# EAGLE design garage door opener v2 2015 07 16 (EAGLE 7.3.0)
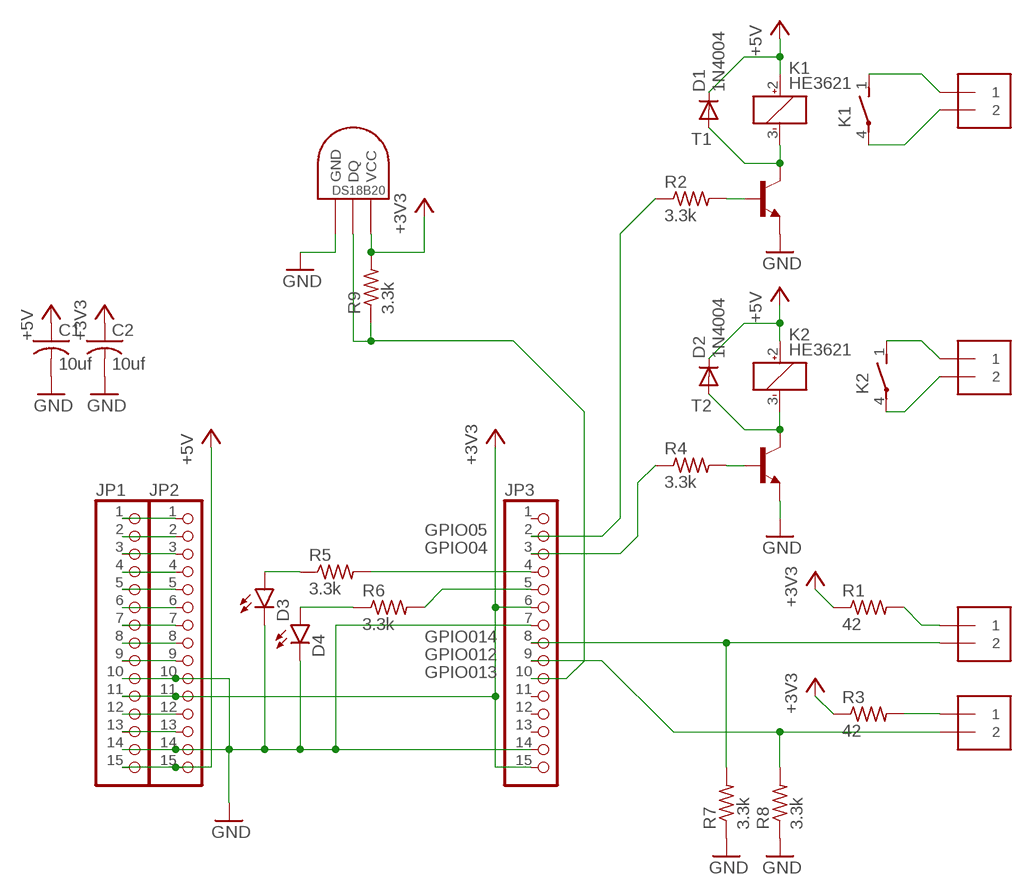
[diagram p0: schematic, sheet 1]

## Parts
C1  10uf  C-USC0603  [C0603]
C2  10uf  C-USC0603  [C0603]
D1  1N4004  DIODE-DO214BA  [DO214BA]
D2  1N4004  DIODE-DO214BA  [DO214BA]
D3  LED0603  [LED-0603]
D4  LED0603  [LED-0603]
DS18B20  DS18B20TO92  DS1820TO92  [DS1820]
JP1  PINHD-1X15  [1X15]
JP2  PINHD-1X15  [1X15]
JP3  PINHD-1X15  [1X15]
K1  HE3621  [HE3621]
K2  HE3621  [HE3621]
OPEN1  1X2-3.5MM  [1X2-3.5MM]
OPEN2  1X2-3.5MM  [1X2-3.5MM]
R1  42  R-US_R0603  [R0603]
R2  3.3k  R-US_R0603  [R0603]
R3  42  R-US_R0603  [R0603]
R4  3.3k  R-US_R0603  [R0603]
R5  3.3k  R-US_R0603  [R0603]
R6  3.3k  R-US_R0603  [R0603]
R7  3.3k  R-US_R0603  [R0603]
R8  3.3k  R-US_R0603  [R0603]
R9  3.3k  R-US_R0603  [R0603]
SENS1  1X2-3.5MM  [1X2-3.5MM]
SENS2  1X2-3.5MM  [1X2-3.5MM]
T1  MMBT3904LT1-NPN-SOT23-BEC  [SOT23-BEC]
T2  MMBT3904LT1-NPN-SOT23-BEC  [SOT23-BEC]

## Nets
+3V3: C2.1 DS18B20.VDD(VCC) JP1.11 JP2.11 JP3.6 JP3.15 R1.1 R3.1 R9.2
+5V: C1.1 D1.C D2.C JP1.15 JP2.15 K1.2(1:+) K2.2(1:+)
GND: C1.2 C2.2 D3.C D4.C DS18B20.GND JP1.10 JP1.14 JP2.10 JP2.14 JP3.7 JP3.14 R7.1 R8.1 T1.E T2.E
N$1: JP1.1 JP2.1
N$2: JP1.2 JP2.2
N$3: JP1.3 JP2.3
N$4: JP1.4 JP2.4
N$5: JP1.5 JP2.5
N$6: JP1.6 JP2.6
N$7: JP1.7 JP2.7
N$8: JP1.8 JP2.8
N$9: JP1.9 JP2.9
N$10: K1.1(2:S) OPEN1.1
N$11: K1.4(2:P) OPEN1.2
N$12: JP1.12 JP2.12
N$13: JP1.13 JP2.13
N$14: JP3.8 R7.2 SENS1.2
N$15: R1.2 SENS1.1
N$16: D1.A K1.3(1:-) T1.C
N$17: JP3.2 R2.1
N$18: R2.2 T1.B
N$19: JP3.4 R5.2
N$20: JP3.5 R6.2
N$21: R3.2 SENS2.1
N$22: JP3.9 R8.2 SENS2.2
N$23: K2.1(2:S) OPEN2.1
N$24: K2.4(2:P) OPEN2.2
N$25: D2.A K2.3(1:-) T2.C
N$26: JP3.3 R4.1
N$27: R4.2 T2.B
N$28: D4.A R6.1
N$29: D3.A R5.1
N$30: DS18B20.DQ JP3.10 R9.1
Unconnected: JP3.1 JP3.11 JP3.12 JP3.13

## Notes on the sheet
- GPIO05
- GPIO04
- GPIO014
- GPIO012
- GPIO013

## Library data of the parts
C1 C2 = resistor:C-US: CAPACITOR, American symbol
D1 D2 = diode:DIODE-: DIODE
D3 D4 = SparkFun-LED:LED: LEDs Standard schematic elements and footprints for 5mm, 3mm, 1206, and 0603 sized LEDs. 5mm - Spark Fun Electronics SKU : COM-00529 (and others)
DS18B20 = Ava:DS1820: DS18B20 Programmable Resolution 1-Wire Digital Thermometer Description The DS18B20 digital thermometer provides 9-bit to 12-bit Celsius temperature measurements and has an alarm function with nonvolatile user-programmable upper and lower trigger points. The DS18B20 communicates over a 1-Wire® bus that by definition requires only one data line (and ground) for communication with a central microprocessor. It has an operating temperature range of -55°C to +125°C and is accurate to ±0.5°C over the range of -10°C to +85°C. In addition, the DS18B20 can derive power directly from the data line ("parasite power"), eliminating the need for an external power supply. Each DS18B20 has a unique 64-bit serial code, which allows multiple DS18B20s to function on the same 1-Wire bus. Thus, it is simple to use one microprocessor to control many DS18B20s distributed over a large area. Applications that can benefit from this feature include HVAC environmental controls, temperature monitoring systems inside buildings, equipment, or machinery, and process monitoring and control systems.
JP1-JP3 = pinhead:PINHD-1X15: PIN HEADER
K1 K2 = relay:HE3621: RELAY reed, 1 x norm. open, grid 5.08 mm, Hamlin; MF: HAMLIN; MPN: HE3621A0510; OC_FARNELL: 9561943; OC_NEWARK: 50F7993
OPEN1 OPEN2 SENS1 SENS2 = adafruit:1X2: 3.5mm Terminal block http://www.ladyada.net/library/pcb/eaglelibrary.html; MPN: OSTTE020161
R1-R9 = resistor:R-US_: RESISTOR, American symbol
T1 T2 = transistor-neu-to92:*-NPN-: NPN Transistror; MPN: MMBT2222A

## Net classes
0 default: width 0.406 mm

## Board
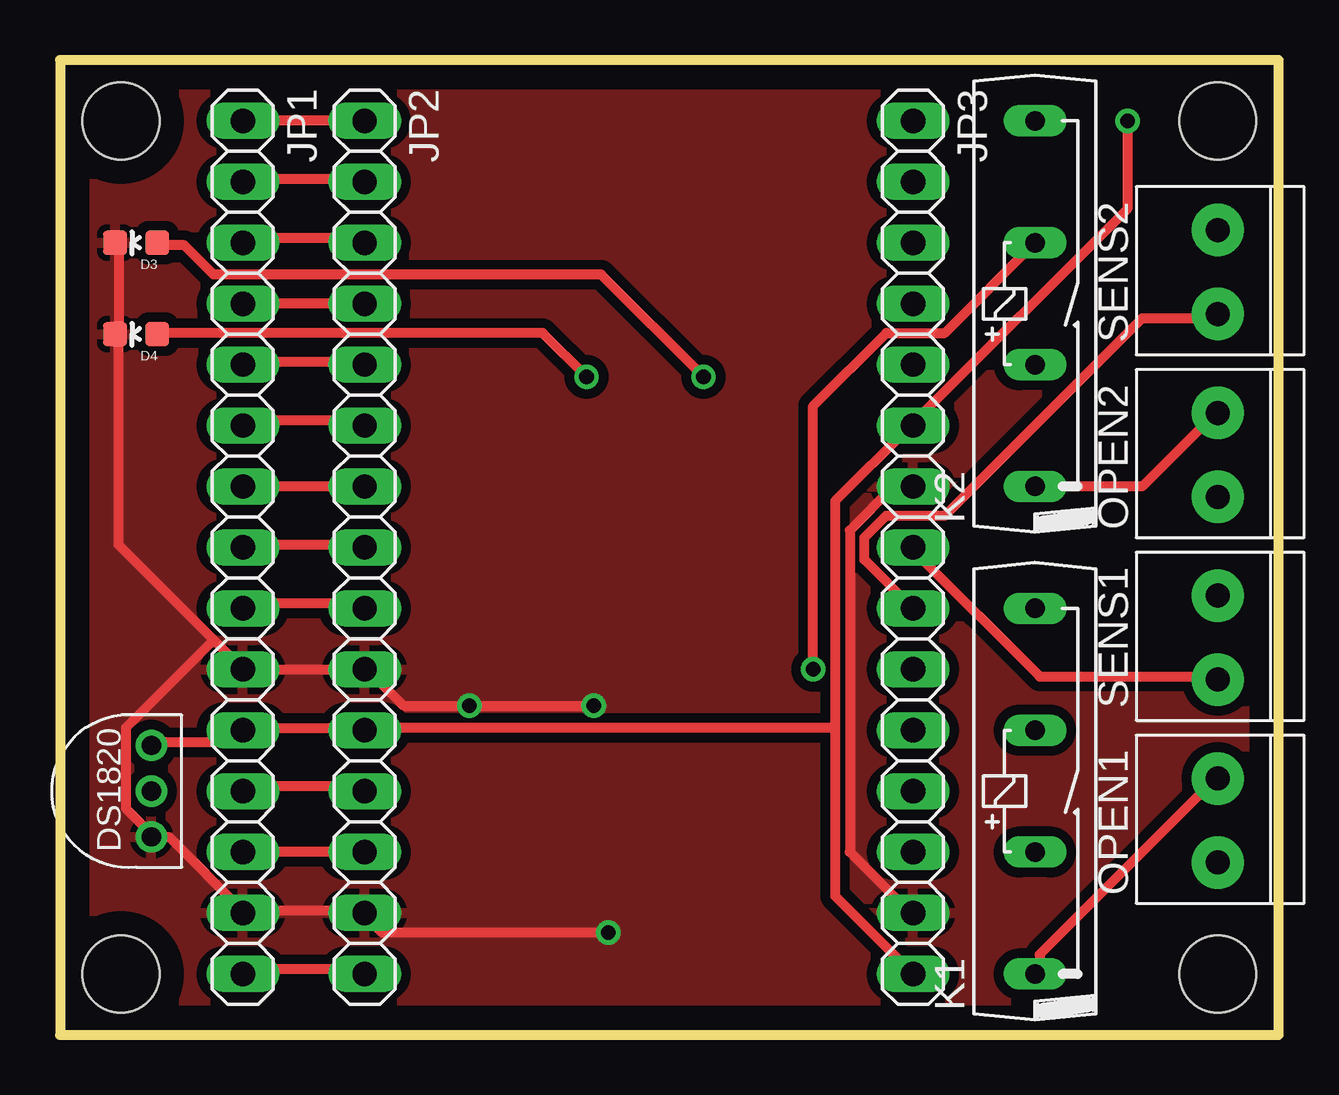
[diagram p1: board, top side]
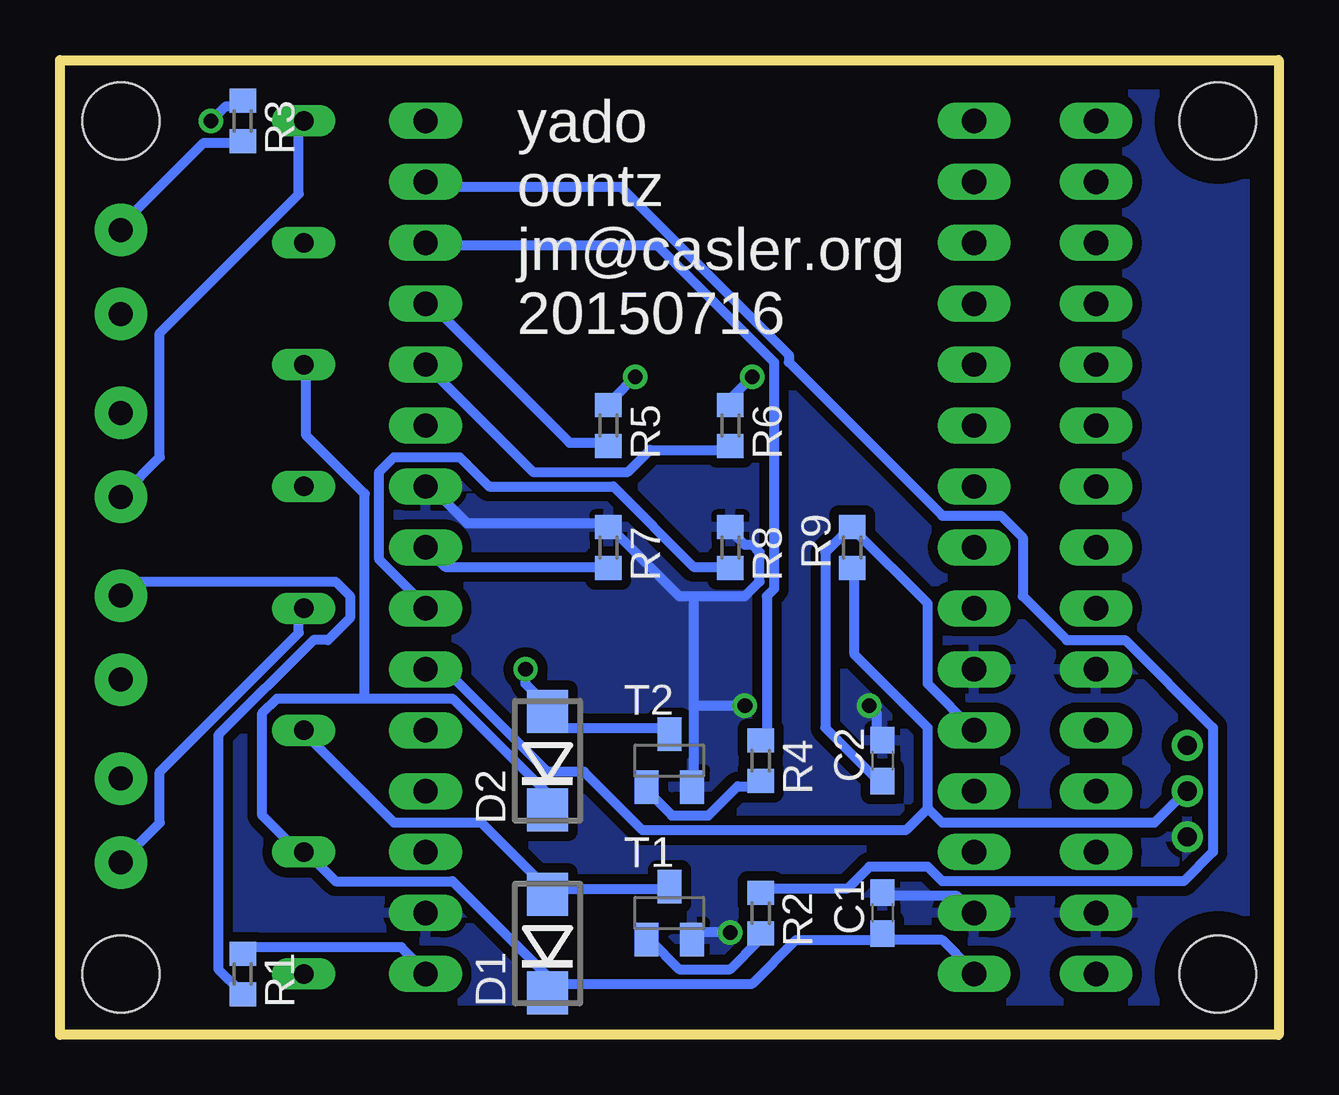
[diagram p2: board, bottom side, seen from below]

Size 50.8 x 40.64 mm. Coordinates in mm from the lower left corner, seen from the top.
Outline: 0,0 50.8,0 50.8,40.64 0,40.64 0,0
Copper layers (1*16): Top 0.035mm / dielectric 1.5mm / Bottom 0.035mm
Design rules "default *": minimum track width 10mil, minimum drill 24mil, track to track 8mil, track to pad 8mil, pad to pad 8mil, via to via 8mil, smd to smd 8mil, copper to edge 40mil, drill to drill 8mil, minimum pad ring 10mil, minimum via ring 8mil, stop-mask expansion 4mil, vias tented up to drill 25mil, thermal gap 10mil
Holes 3.2 mm at 2.54,38.1 2.54,2.54 48.26,38.1 48.26,2.54

### Footprints (pad centres in the part's own frame; a part is rotated, then mirrored left to right if it is on the bottom)
C0603 = smd 1.1 x 1: 1 -0.85,0; 2 0.85,0
DO214BA = smd 1.8 x 1.7: A 2.05,0; C -2.05,0
LED-0603 = smd 1 x 1: A 0,-0.877; C 0,0.877
DS1820 = drill 0.8: DQ 2.54,-1.27; GND 0.635,-1.27; VDD 4.445,-1.27
1X15 = drill 1.016 long: 1 -17.78,0; 2 -15.24,0; 3 -12.7,0; 4 -10.16,0; 5 -7.62,0; 6 -5.08,0; 7 -2.54,0; 8 0,0; 9 2.54,0; 10 5.08,0; 11 7.62,0; 12 10.16,0; 13 12.7,0; 14 15.24,0; 15 17.78,0
HE3621 = drill 0.813 long: 1 -7.62,0; 2 -2.54,0; 3 2.54,0; 4 7.62,0
1X2-3.5MM = drill 1 pad 2.184: 1 1.8,0; 2 -1.7,0
R0603 = smd 1 x 1.1: 1 -0.85,0; 2 0.85,0
SOT23-BEC = smd 1 x 1.4: B -0.95,-1.1; C 0,1.1; E 0.95,-1.1

### Placement (x,y rotation side)
C1  16.51,5.08 90 bottom
C2  16.51,11.43 90 bottom
D1  30.48,3.81 90 bottom
D2  30.48,11.43 90 bottom
D3  3.17,33.02 90 top
D4  3.17,29.21 90 top
DS18B20  2.54,7.62 90 top
JP1  7.62,20.32 270 top
JP2  12.7,20.32 270 top
JP3  35.56,20.32 270 top
K1  40.64,10.16 90 top
K2  40.64,30.48 90 top
OPEN1  48.26,8.89 90 top
OPEN2  48.26,24.13 90 top
R1  43.18,2.54 270 bottom
R2  21.59,5.08 270 bottom
R3  43.18,38.1 270 bottom
R4  21.59,11.43 270 bottom
R5  27.94,25.4 270 bottom
R6  22.86,25.4 270 bottom
R7  27.94,20.32 270 bottom
R8  22.86,20.32 270 bottom
R9  17.78,20.32 90 bottom
SENS1  48.26,16.51 90 top
SENS2  48.26,31.75 90 top
T1  25.4,5.08 0 bottom
T2  25.4,11.43 0 bottom

### Tracks (layer width: path | path; a pad name or v marks a point on that pad's centre or on a via)
+3V3  (via drill 0.61)
  Top 0.406: DS18B20.VDD 3.96,12.19 7.32,12.19 7.62,12.5 JP1.11 7.62,12.8 12.5,12.8 JP2.11 12.8,12.8 32.31,12.8 | v44.5,38.1 44.5,34.44 35.66,25.6 JP3.6 35.36,25.3 32.31,22.25 32.31,12.8 | JP3.15 32.31,5.79 32.31,12.8
  Bottom 0.406: C2.1 16.76,10.67 18.9,12.8 18.9,20.12 17.98,21.03 R9.2 17.68,21.03 14.63,17.98 14.63,14.63 JP2.11 | R1.1 42.98,3.66 36.58,3.66 35.66,2.74 JP3.15 | v44.5,38.1 43.89,38.71 43.28,38.71 R3.1
+5V
  Top 0.406: JP1.15 7.62,2.74 12.5,2.74 JP2.15
  Bottom 0.406: JP2.15 12.8,2.74 14.02,3.96 16.46,3.96 C1.1 16.76,3.96 20.12,3.96 21.95,2.13 30.48,2.13 | 30.48,2.13 30.48,2.44 34.44,6.4 39.32,6.4 40.54,7.62 K1.2 40.84,7.62 42.37,9.14 42.37,13.41 41.76,14.02 38.1,14.02 | 30.48,2.13 D1.C 30.48,1.83 | D2.C 30.48,10.06 34.44,14.02 38.1,14.02 | 38.1,14.02 38.1,22.55 40.54,24.99 40.54,27.74 K2.2
GND  (via drill 0.61)
  Top 0.406: JP3.7 34.75,22.86 32.92,21.03 32.92,7.62 35.36,5.18 JP3.14 | 7.62,5.18 4.57,8.23 3.96,8.23 DS18B20.GND 3.66,8.53 2.74,9.45 2.74,12.8 6.4,16.46 | v22.86,4.27 13.41,4.27 12.8,4.88 JP2.14 12.5,5.18 7.62,5.18 | 7.62,5.18 JP1.14 | D3.C 2.44,32.92 2.44,29.26 D4.C 2.44,28.96 2.44,20.42 6.4,16.46 | 6.4,16.46 JP1.10 JP2.10 12.8,15.24 14.33,13.72 v17.07,13.72 v22.25,13.72
  Bottom 0.406: 24.38,18.29 24.99,18.29 27.74,21.03 R7.1 28.04,21.34 33.83,21.34 35.36,22.86 JP3.7 | 24.38,18.29 22.25,18.29 21.64,18.9 21.64,20.12 21.95,20.42 22.25,20.42 22.86,21.03 R8.1 | 24.38,18.29 24.38,13.72 | 24.38,13.72 24.38,10.36 T2.E | JP2.14 13.41,5.79 16.46,5.79 C1.2 | v22.86,4.27 24.38,4.27 T1.E | v17.07,13.72 16.76,13.41 16.76,12.5 C2.2 | v22.25,13.72 24.38,13.72
  pour Top (isolate 0.406): -1.27,41.91 52.07,41.91 52.07,-1.27 -1.27,-1.27
  pour Bottom (isolate 0.406): -2.54,43.18 53.34,43.18 53.34,-2.54 -2.54,-2.54
N$1
  Top 0.406: JP2.1 JP1.1
N$2
  Top 0.406: JP1.2 7.62,35.66 12.5,35.66 JP2.2
N$3
  Top 0.406: JP1.3 7.62,33.22 12.5,33.22 JP2.3
N$4
  Top 0.406: JP2.4 JP1.4
N$5
  Top 0.406: JP1.5 7.62,28.04 12.5,28.04 JP2.5
N$6
  Top 0.406: JP1.6 7.62,25.6 12.5,25.6 JP2.6
N$7
  Top 0.406: JP2.7 JP1.7
N$8
  Top 0.406: JP1.8 7.62,20.42 12.5,20.42 JP2.8
N$9
  Top 0.406: JP1.9 7.62,17.98 12.5,17.98 JP2.9
N$10
  Top 0.406: K1.1 40.84,2.74 40.84,3.35 48.16,10.67 OPEN1.1
N$11
  Bottom 0.406: K1.4 40.84,17.68 40.84,16.76 46.63,10.97 46.63,8.84 48.16,7.32 OPEN1.2
N$12
  Top 0.406: JP1.12 7.62,10.36 12.5,10.36 JP2.12
N$13
  Top 0.406: JP2.13 JP1.13
N$14
  Top 0.406: SENS1.2 48.16,14.94 40.84,14.94 35.66,20.12 JP3.8
  Bottom 0.406: JP3.8 34.75,19.51 28.04,19.51 R7.2
N$15
  Bottom 0.406: R1.2 43.28,1.83 44.2,2.74 44.2,12.5 40.23,16.46 39.62,16.46 38.71,17.37 38.71,18.29 39.32,18.9 47.85,18.9 48.16,18.59 SENS1.1
N$16
  Bottom 0.406: 30.48,6.1 25.6,6.1 T1.C | 30.48,6.1 33.22,8.84 36.88,8.84 40.54,12.5 K1.3 | 30.48,6.1 D1.A
N$17
  Bottom 0.406: R2.1 21.34,6.1 17.98,6.1 17.07,7.01 14.63,7.01 14.02,6.4 3.96,6.4 2.74,7.62 2.74,12.8 6.4,16.46 8.84,16.46 10.67,18.29 10.67,20.73 11.58,21.64 14.02,21.64 20.42,28.04 20.42,28.35 27.43,35.36 35.36,35.36 JP3.2
N$18
  Bottom 0.406: R2.2 21.64,3.96 22.86,2.74 24.99,2.74 26.21,3.96 T1.B
N$19
  Bottom 0.406: R5.2 28.04,24.69 29.57,24.69 35.36,30.48 JP3.4
N$20
  Bottom 0.406: JP3.5 31.09,23.47 27.13,23.47 26.21,24.38 22.86,24.38 R6.2
N$21
  Bottom 0.406: R3.2 43.28,37.19 44.81,37.19 48.16,33.83 SENS2.1
N$22
  Top 0.406: JP3.9 33.53,19.81 33.53,20.73 34.44,21.64 36.88,21.64 45.11,29.87 48.16,29.87 SENS2.2
  Bottom 0.406: R8.2 22.86,19.51 24.38,19.51 27.74,22.86 32.92,22.86 34.14,24.08 36.88,24.08 37.49,23.47 37.49,19.81 35.66,17.98 JP3.9
N$23
  Top 0.406: K2.1 45.11,22.86 48.16,25.91 OPEN2.1
N$24
  Bottom 0.406: K2.4 40.84,38.1 40.84,35.05 46.63,29.26 46.63,24.08 48.16,22.55 OPEN2.2
N$25  (via drill 0.61)
  Top 0.406: K2.3 36.88,29.26 34.44,29.26 31.39,26.21 v31.39,15.24
  Bottom 0.406: T2.C 25.6,12.8 29.87,12.8 30.48,13.41 D2.A 30.48,13.72 31.39,14.63 v31.39,15.24
N$26
  Bottom 0.406: R4.1 21.34,12.5 21.34,18.29 21.03,18.59 21.03,28.04 25.91,32.92 35.36,32.92 JP3.3
N$27
  Bottom 0.406: R4.2 21.64,10.36 22.55,10.36 23.77,9.14 25.3,9.14 26.21,10.06 T2.B
N$28  (via drill 0.61)
  Top 0.406: v21.95,27.43 20.12,29.26 4.27,29.26 D4.A
  Bottom 0.406: v21.95,27.43 22.86,26.52 R6.1
N$29  (via drill 0.61)
  Top 0.406: v26.82,27.43 22.55,31.7 6.4,31.7 5.18,32.92 4.27,32.92 D3.A
  Bottom 0.406: v26.82,27.43 27.74,26.52 R5.1
N$30
  Bottom 0.406: 14.63,9.45 14.63,12.8 17.68,15.85 17.68,19.2 R9.1 | 14.63,9.45 14.02,8.84 5.18,8.84 3.96,10.06 DS18B20.DQ | JP3.10 34.75,15.24 30.48,10.97 28.96,10.97 26.52,8.53 15.54,8.53 14.63,9.45

### Text on the board
bPlace: yado / oontz / jm@casler.org / 20150716